# EAGLE design gadgiteration_v21 (EAGLE 6.4)
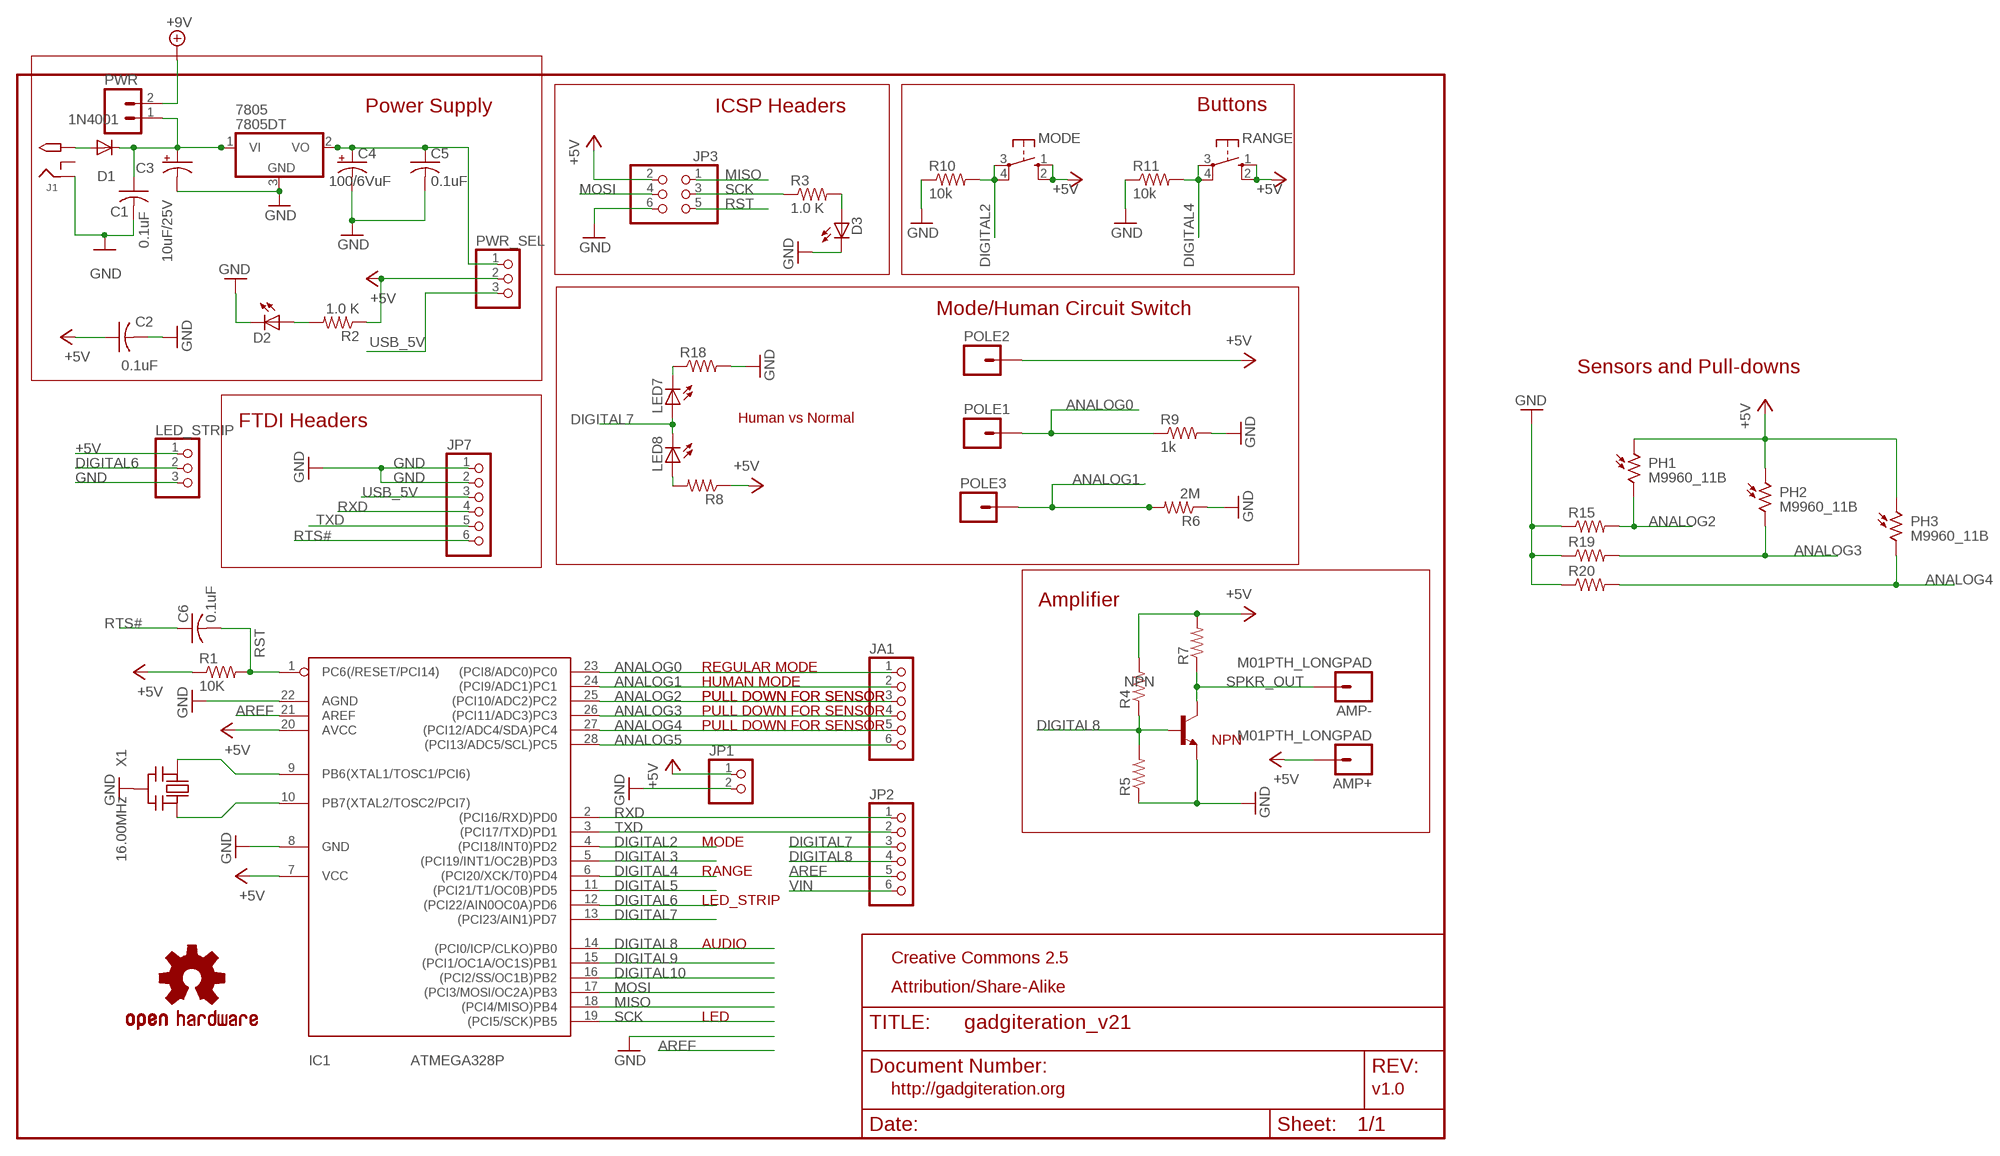
[diagram p0: schematic, sheet 1]

## Parts
7805  7805DT  [TO252]
AMP+  M01PTH_LONGPAD  [1X01_LONGPAD]
AMP-  M01PTH_LONGPAD  [1X01_LONGPAD]
C1  0.1uF  C-US025-025X050  [C025-025X050]
C2  0.1uF  C-US025-025X050  [C025-025X050]
C3  10uF/25V  CPOL-USE2.5-6  [E2,5-6]
C4  100/6VuF  CPOL-USE2.5-6  [E2,5-6]
C5  0.1uF  C-US025-025X050  [C025-025X050]
C6  0.1uF  C-US025-025X050  [C025-025X050]
D1  1N4001  DIODEPTH  [DIODE-1N4001]
D2  LED3MM  [LED3MM]
D3  Green  LED3MM  [LED3MM]
IC1  ATMEGA328P  ATMEGA168PROUND  [DIL28/3]
J1  2.1MMJACK  [PJ-102A]
JA1  PINHD-1X6CB  [1X06-CLEANBIG]
JP1  PINHD-1X2CB  [1X02-CB]
JP2  PINHD-1X6CB  [1X06-CLEANBIG]
JP3  PINHD-2X3  [2X03]
JP7  PINHD-1X6CLEAN  [1X06-CLEAN]
LED7  LED3MM  [LED3MM]
LED8  LED3MM  [LED3MM]
LED_STRIP  PINHD-1X3  [1X03]
LOGO1  OSHW-LOGOM  [OSHW-LOGO-M]
MODE  10-XX  [B3F-10XX]
NPN  -NPN-TO220V  [TO220V]
PH1  M9960_11B  [M9960]
PH2  M9960_11B  [M9960]
PH3  M9960_11B  [M9960]
POLE1  M01PTH_LONGPAD  [1X01_LONGPAD]
POLE2  M01PTH_LONGPAD  [1X01_LONGPAD]
POLE3  M01PTH_LONGPAD  [1X01_LONGPAD]
PWR  M02LOCK  [1X02_LOCK]
PWR_SEL  PINHD-1X3  [1X03]
R1  10K  R-US_0204/5  [0204/5]
R2  1.0 K  R-US_0204/5  [0204/5]
R3  1.0 K  R-US_0204/5  [0204/5]
R4  R-US_0204/5  [0204/5]
R5  R-US_0204/5  [0204/5]
R6  2M  R-US_0204/5  [0204/5]
R7  R-US_0204/5  [0204/5]
R8  R-US_0204/5  [0204/5]
R9  1k  R-US_0204/5  [0204/5]
R10  10k  R-US_0204/5  [0204/5]
R11  10k  R-US_0204/5  [0204/5]
R15  R-US_0204/5  [0204/5]
R18  R-US_0204/5  [0204/5]
R19  R-US_0204/5  [0204/5]
R20  R-US_0204/5  [0204/5]
RANGE  10-XX  [B3F-10XX]
X1  16.00MHz  CERMOSCILL  [CERM_OSC]

## Nets
+5V: AMP+.1 C2.1 IC1.7(VCC) IC1.20(AVCC) JP1.1 JP3.2 LED_STRIP.1 MODE.1(S) MODE.2(S1) PH1.1 PH2.1 PH3.1 POLE2.1 PWR_SEL.2 R1.1 R2.1 R4.2 R7.2 R8.1 RANGE.1(S) RANGE.2(S1)
+9V: PWR.2
ANALOG0: IC1.23((PCI8/ADC0)PC0) JA1.1 POLE1.1 R9.1
ANALOG1: IC1.24((PCI9/ADC1)PC1) JA1.2 POLE3.1 R6.2
ANALOG2: IC1.25((PCI10/ADC2)PC2) JA1.3 PH1.2 R15.2
ANALOG3: IC1.26((PCI11/ADC3)PC3) JA1.4 PH2.2 R19.2
ANALOG4: IC1.27((PCI12/ADC4/SDA)PC4) JA1.5 PH3.2 R20.2
ANALOG5: IC1.28((PCI13/ADC5/SCL)PC5) JA1.6
AREF: IC1.21(AREF) JP2.5
DIGITAL2: IC1.4((PCI18/INT0)PD2) MODE.3(P) MODE.4(P1) R10.2
DIGITAL3: IC1.5((PCI19/INT1/OC2B)PD3)
DIGITAL4: IC1.6((PCI20/XCK/T0)PD4) R11.2 RANGE.3(P) RANGE.4(P1)
DIGITAL5: IC1.11((PCI21/T1/OC0B)PD5)
DIGITAL6: IC1.12((PCI22/AIN0OC0A)PD6) LED_STRIP.2
DIGITAL7: IC1.13((PCI23/AIN1)PD7) JP2.3 LED7.A LED8.K(C)
DIGITAL8: IC1.14((PCI0/ICP/CLKO)PB0) JP2.4 NPN.1(B) R4.1 R5.2
DIGITAL9: IC1.15((PCI1/OC1A/OC1S)PB1)
DIGITAL10: IC1.16((PCI2/SS/OC1B)PB2)
GND: 7805.3(GND) C1.2 C2.2 C3.- C4.- C5.2 D2.K(C) D3.K(C) IC1.8(GND) IC1.22(AGND) J1.RING JP1.2 JP3.6 JP7.1 JP7.2 LED_STRIP.3 NPN.3(E) R5.1 R6.1 R9.2 R10.1 R11.1 R15.1 R18.2 R19.1 R20.1 X1.P$2(GND)
MISO: IC1.18((PCI4/MISO)PB4) JP3.1
MOSI: IC1.17((PCI3/MOSI/OC2A)PB3) JP3.4
N$1: IC1.9(PB6(XTAL1/TOSC1/PCI6)) X1.P$1(IN)
N$2: IC1.10(PB7(XTAL2/TOSC2/PCI7)) X1.P$3(OUT)
N$3: D2.A R2.2
N$4: D3.A R3.2
N$6: LED7.K(C) R18.1
N$7: LED8.A R8.2
N$17: D1.A J1.TIP
N$22: 7805.2(VO) C4.+ C5.1 PWR_SEL.1
RST: C6.2 IC1.1(PC6(/RESET/PCI14)) JP3.5 R1.2
RTS#: C6.1 JP7.6
RXD: IC1.2((PCI16/RXD)PD0) JP2.1 JP7.4
SCK: IC1.19((PCI5/SCK)PB5) JP3.3 R3.1
SPKR_OUT: AMP-.1 NPN.2(C) R7.1
TXD: IC1.3((PCI17/TXD)PD1) JP2.2 JP7.5
USB_5V: JP7.3 PWR_SEL.3
VIN: 7805.1(VI) C1.1 C3.+ D1.C JP2.6 PWR.1
Unconnected: J1.RING_SW

## Notes on the sheet
- Power Supply | ICSP Headers | Buttons
- Mode/Human Circuit Switch
- Sensors and Pull-downs
- Human vs Normal
- FTDI Headers
- Amplifier
- REGULAR MODE
- HUMAN MODE
- PULL DOWN FOR SENSOR | PULL DOWN FOR SENSOR
- PULL DOWN FOR SENSOR
- PULL DOWN FOR SENSOR
- NPN
- MODE
- RANGE
- LED_STRIP
- AUDIO
- Creative Commons 2.5
- Attribution/Share-Alike
- LED
- http://gadgiteration.org | v1.0

## Library data of the parts
7805 = linear:78*: Positive VOLTAGE REGULATOR Source: http://cache.national.com/ds/LM/LM78L05.pdf http://www.fairchildsemi.com/ds/LM/LM7805.pdf
AMP+ AMP- POLE1-POLE3 = SparkFun-Connectors:M01: Header 1 Standard 1-pin 0.1" header. Use with straight break away headers (SKU : PRT-00116), right angle break away headers (PRT-00553), swiss pins (PRT-00743), machine pins (PRT-00117), and female headers (PRT-00115).
C1 C2 C5 C6 = minimidi:C-US: CAPACITOR, American symbol
C3 C4 = minimidi:CPOL-US: POLARIZED CAPACITOR, American symbol
D1 = SparkFun-DiscreteSemi:DIODE: Diode These are standard reverse protection diodes and small signal diodes. SMA package can handle up to about 1A. SOD-323 can handle about 200mA. What the SOD-323 package when ordering, there are some mfgs out there that are 5-pin packages.
D2 D3 = minimidi:LED: LED OSRAM: - CHIPLED LG R971, LG N971, LY N971, LG Q971, LY Q971, LO R971, LY R971 LH N974, LH R974 LS Q976, LO Q976, LY Q976 LO Q996 - Hyper CHIPLED LW Q18S LB Q993, LB Q99A, LB R99A - SideLED LS A670, LO A670, LY A670, LG A670, LP A670 LB A673, LV A673, LT A673, LW A673 LH A674 LY A675 LS A676, LA A676, LO A676, LY A676, LW A676 LS A679, LY A679, LG A679 - Hyper Micro SIDELED® LS Y876, LA Y876, LO Y876, LY Y876 LT Y87S - SmartLED LW L88C, LW L88S LB L89C, LB L89S, LG L890 LS L89K, LO L89K, LY L89K LS L896, LA L896, LO L896, LY L896 - TOPLED LS T670, LO T670, LY T670, LG T670, LP T670 LSG T670, LSP T670, LSY T670, LOP T670, LYG T670 LG T671, LOG T671, LSG T671 LB T673, LV T673, LT T673, LW T673 LH T674 LS T676, LA T676, LO T676, LY T676, LB T676, LH T676, LSB T676, LW T676 LB T67C, LV T67C, LT T67C, LS T67K, LO T67K, LY T67K, LW E67C LS E67B, LA E67B, LO E67B, LY E67B, LB E67C, LV E67C, LT E67C LW T67C LS T679, LY T679, LG T679 LS T770, LO T770, LY T770, LG T770, LP T770 LB T773, LV T773, LT T773, LW T773 LH T774 LS E675, LA E675, LY E675, LS T675 LS T776, LA T776, LO T776, LY T776, LB T776 LHGB T686 LT T68C, LB T68C - Hyper Mini TOPLED® LB M676 - Mini TOPLED Santana® LG M470 LS M47K, LO M47K, LY M47K Source: http://www.osram.convergy.de/
IC1 = avr:ATMEGA168*P: MICROCONTROLLER 16 kBytes FLASH 1 kBytes SRAM 512 Bytes EEPROM USART 8-channel 10 bit ADC
J1 = minimidi:2.1MMJACK
JA1 JP7 = carduino:PINHD-1X6: PIN HEADER
JP1 = carduino:PINHD-1X2: PIN HEADER
JP2 = adafruit:PINHD-1X6: PIN HEADER
JP3 = pinhead-ez:PINHD-2X3: PIN HEADER
LED7 LED8 = adafruit:LED: LED OSRAM: - CHIPLED LG R971, LG N971, LY N971, LG Q971, LY Q971, LO R971, LY R971 LH N974, LH R974 LS Q976, LO Q976, LY Q976 LO Q996 - Hyper CHIPLED LW Q18S LB Q993, LB Q99A, LB R99A - SideLED LS A670, LO A670, LY A670, LG A670, LP A670 LB A673, LV A673, LT A673, LW A673 LH A674 LY A675 LS A676, LA A676, LO A676, LY A676, LW A676 LS A679, LY A679, LG A679 - Hyper Micro SIDELED® LS Y876, LA Y876, LO Y876, LY Y876 LT Y87S - SmartLED LW L88C, LW L88S LB L89C, LB L89S, LG L890 LS L89K, LO L89K, LY L89K LS L896, LA L896, LO L896, LY L896 - TOPLED LS T670, LO T670, LY T670, LG T670, LP T670 LSG T670, LSP T670, LSY T670, LOP T670, LYG T670 LG T671, LOG T671, LSG T671 LB T673, LV T673, LT T673, LW T673 LH T674 LS T676, LA T676, LO T676, LY T676, LB T676, LH T676, LSB T676, LW T676 LB T67C, LV T67C, LT T67C, LS T67K, LO T67K, LY T67K, LW E67C LS E67B, LA E67B, LO E67B, LY E67B, LB E67C, LV E67C, LT E67C LW T67C LS T679, LY T679, LG T679 LS T770, LO T770, LY T770, LG T770, LP T770 LB T773, LV T773, LT T773, LW T773 LH T774 LS E675, LA E675, LY E675, LS T675 LS T776, LA T776, LO T776, LY T776, LB T776 LHGB T686 LT T68C, LB T68C - Hyper Mini TOPLED® LB M676 - Mini TOPLED Santana® LG M470 LS M47K, LO M47K, LY M47K Source: http://www.osram.convergy.de/
LED_STRIP PWR_SEL = pinhead:PINHD-1X3: PIN HEADER
LOGO1 = SparkFun-Aesthetics:OSHW-LOGO: Open Source Hardware Logo This logo indicates the piece of hardware it is found on incorporates a OSHW license and/or adheres to the definition of open source hardware found here: http://freedomdefined.org/OSHW
MODE RANGE = switch-omron:10-XX: OMRON SWITCH
NPN = transistor:*-NPN-: NPN Transistror BF959 corrected 2008.03.06
PH1-PH3 = photo-elements:M9960_11: Photo Sensor Beacon Light, Photometer Applications Source: http://optoelectronics.perkinelmer.com/content/Datasheets/DTS_M9960.pdf
PWR = SparkFun-Connectors:M02: Header 2 Standard 2-pin 0.1" header. Use with straight break away headers (SKU : PRT-00116), right angle break away headers (PRT-00553), swiss pins (PRT-00743), machine pins (PRT-00117), and female headers (PRT-00115). Molex polarized connector foot print use with SKU : PRT-08233 with associated crimp pins and housings.
R1-R11 R15 R18-R20 = adafruit:R-US_: RESISTOR, American symbol
X1 = digg:CERMOSCILL

## Board
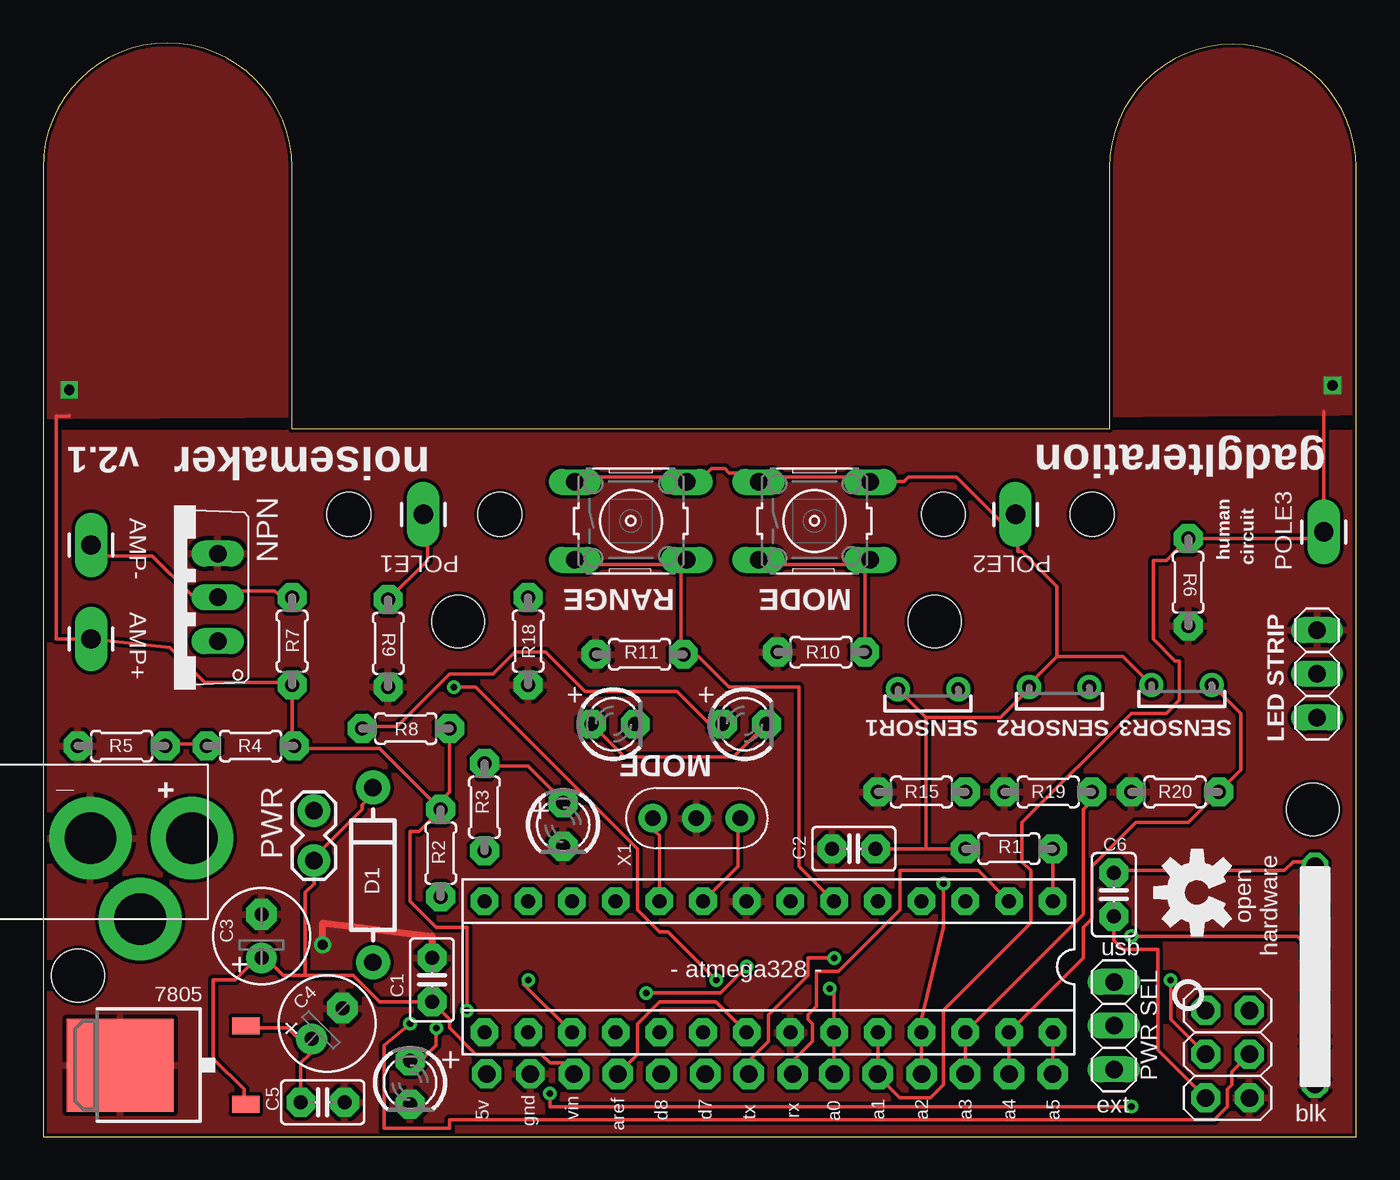
[diagram p1: board, top side]
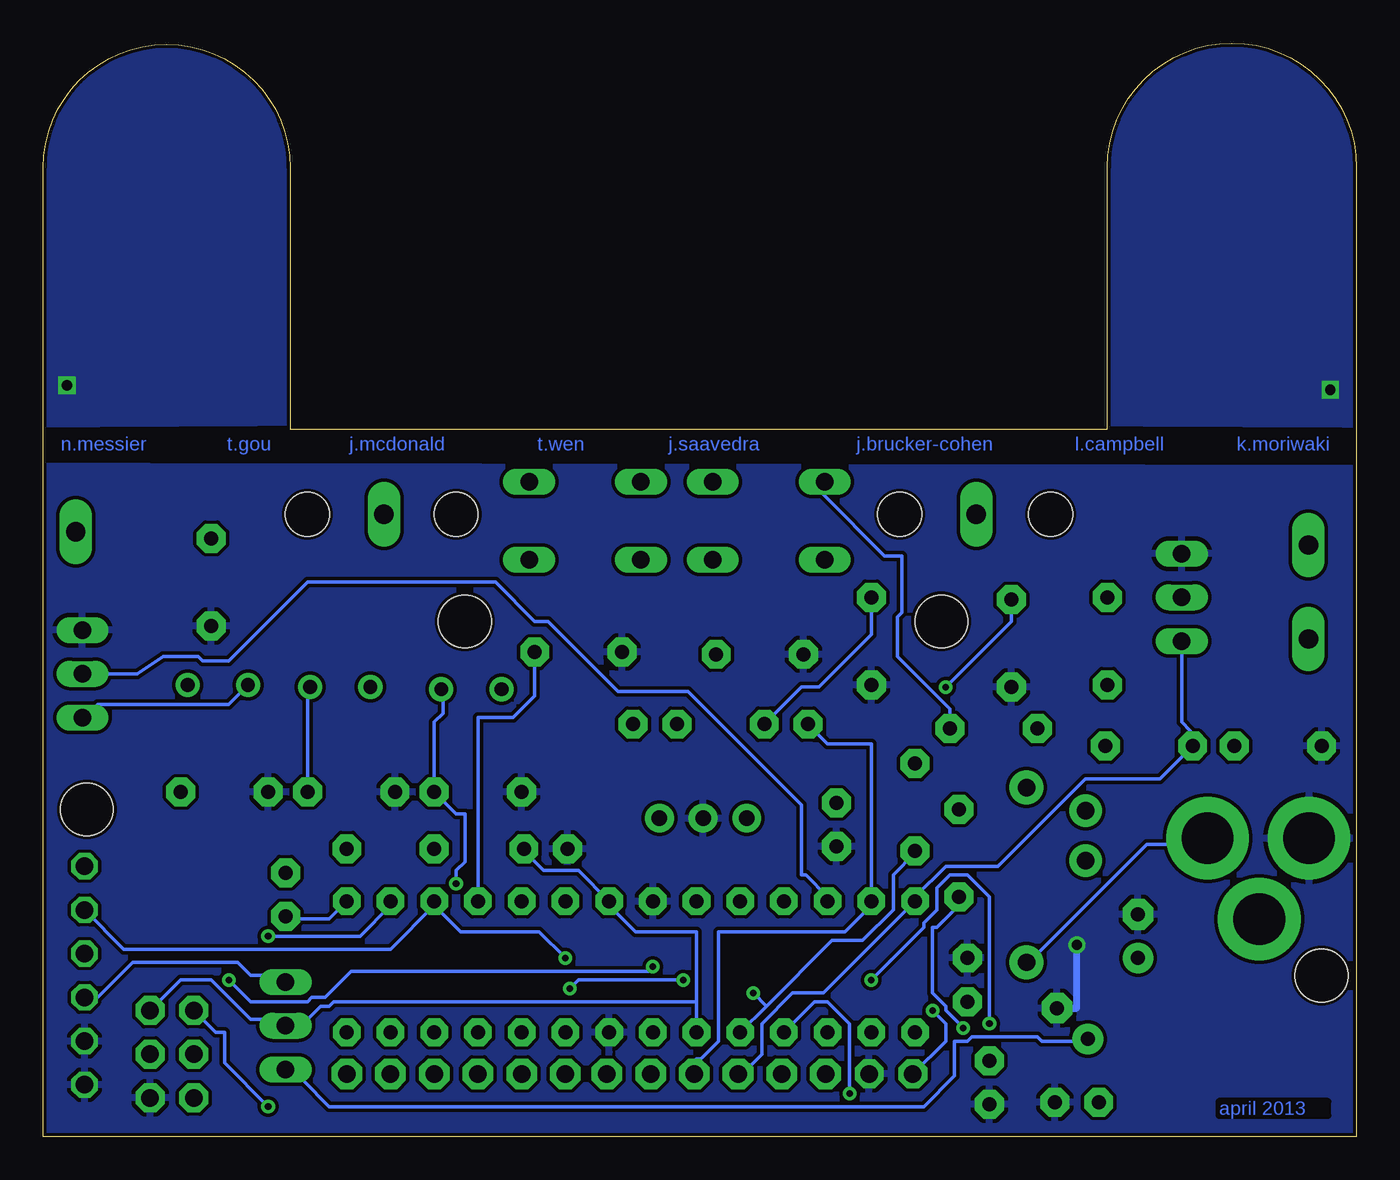
[diagram p2: board, bottom side, seen from below]

Size 76.31 x 63.55 mm. Coordinates in mm from the lower left corner, seen from the top.
Outline: 0,0 76.31,0 76.31,56.31 arc180 61.97,56.31 61.97,41.11 14.47,41.11 14.47,56.31 arc180 0,56.31 0,0
Copper layers (1*16): Top 0.035mm / dielectric 1.5mm / Bottom 0.035mm
Design rules "default": minimum track width 8mil, minimum drill 15mil, track to track 8mil, track to pad 8mil, pad to pad 10mil, via to via 10mil, smd to smd 0mil, copper to edge 8mil, drill to drill 8mil, minimum pad ring 10mil, minimum via ring 8mil, stop-mask expansion 4mil, vias tented up to drill 0mil, thermal gap 10mil
Holes 3.05 mm at 24.12,29.93 73.78,19.01 51.81,29.93 2.03,9.36
Holes 2.54 mm at 17.77,36.16 26.54,36.16 60.96,36.16 52.32,36.16

### Footprints (pad centres in the part's own frame; a part is rotated, then mirrored left to right if it is on the bottom)
TO252 = smd 1 x 1.6: 1 -2.28,-4.8; 2 2.28,-4.8 | smd 5.4 x 6.2: 3 0,2.5
1X01_LONGPAD = drill 1.118 pad 1.88 long: 1 0,0
C025-025X050 = drill 0.813 pad 1.676 octagon: 1 -1.27,0; 2 1.27,0
E2,5-6 = drill 0.813 pad 1.778: + -1.27,0 | drill 0.813 pad 1.778 octagon: - 1.27,0
DIODE-1N4001 = drill 1 pad 1.981: A -5.08,0; C 5.08,0
LED3MM = drill 0.813 pad 1.676 octagon: A -1.27,0; K 1.27,0
DIL28/3 = drill 0.813 pad 1.6 octagon: 1 -16.51,-3.81; 2 -13.97,-3.81; 3 -11.43,-3.81; 4 -8.89,-3.81; 5 -6.35,-3.81; 6 -3.81,-3.81; 7 -1.27,-3.81; 8 1.27,-3.81; 9 3.81,-3.81; 10 6.35,-3.81; 11 8.89,-3.81; 12 11.43,-3.81; 13 13.97,-3.81; 14 16.51,-3.81; 15 16.51,3.81; 16 13.97,3.81; 17 11.43,3.81; 18 8.89,3.81; 19 6.35,3.81; 20 3.81,3.81; 21 1.27,3.81; 22 -1.27,3.81; 23 -3.81,3.81; 24 -6.35,3.81; 25 -8.89,3.81; 26 -11.43,3.81; 27 -13.97,3.81; 28 -16.51,3.81
PJ-102A = drill 3 pad 4.8: RING 0.1,-3.39; RING_SW -4.6,-6.29; TIP 0.1,-9.29
1X06-CLEANBIG = drill 1.016 pad 1.778 octagon: 1 -6.35,0; 2 -3.81,0; 3 -1.27,0; 4 1.27,0; 5 3.81,0; 6 6.35,0
1X02-CB = drill 1.016 pad 1.676 octagon: 1 -1.27,0; 2 1.27,0
2X03 = drill 1.016 pad 1.676 octagon: 1 -2.54,-1.27; 2 -2.54,1.27; 3 0,-1.27; 4 0,1.27; 5 2.54,-1.27; 6 2.54,1.27
1X06-CLEAN = drill 1.016 octagon: 1 -6.35,0; 2 -3.81,0; 3 -1.27,0; 4 1.27,0; 5 3.81,0; 6 6.35,0
1X03 = drill 1.016 long: 1 -2.54,0; 2 0,0; 3 2.54,0
B3F-10XX = drill 1.016 long: 1 -3.251,2.261; 2 3.251,2.261; 3 -3.251,-2.261; 4 3.251,-2.261
TO220V = drill 1.016 long: 1 -2.54,-2.54; 2 0,-2.54; 3 2.54,-2.54
M9960 = drill 0.8 pad 1.4: 1 -1.75,0; 2 1.75,0
1X02_LOCK = drill 1.016 pad 1.88: 1 -0.178,0; 2 2.718,0
0204/5 = drill 0.813 pad 1.676 octagon: 1 -2.54,0; 2 2.54,0
CERM_OSC = drill 0.9 pad 1.676: P$1 -2.54,0; P$2 0,0; P$3 2.54,0

### Placement (x,y rotation side)
7805  6.98,4.15 90 top
AMP+  2.79,28.92 0 top
AMP-  2.79,34.38 0 top
C1  22.6,9.11 90 top
C2  47.11,16.73 180 top
C3  12.7,11.65 90 top
C4  16.5,6.57 45 top
C5  16.25,1.99 0 top
C6  62.23,14.06 270 top
D1  19.17,15.2 90 top
D2  21.33,3.14 270 top
D3  30.22,18.12 270 top
IC1  42.16,9.87 180 top
J1  -0.64,17.23 90 top
JA1  52.32,3.65 0 top
JP1  27.05,3.65 0 top
JP2  37.21,3.65 180 top
JP3  68.83,4.79 270 top
JP7  73.91,9.36 90 top
LED7  33.14,23.96 0 top
LED8  40.76,23.96 0 top
LED_STRIP  74.04,26.89 90 top
LOGO1  67.05,14.19 90 top
MODE  44.83,35.78 0 top
NPN  7.61,31.33 90 top
PH1  51.43,26 0 top
PH2  59.05,26.12 0 top
PH3  66.16,26.25 0 top
POLE1  22.09,36.16 0 top
POLE2  56.51,36.16 0 top
POLE3  74.42,35.14 180 top
PWR  15.74,16.22 90 top
PWR_SEL  62.23,6.44 90 top
R1  56.13,16.73 0 top
R2  23.11,16.47 270 top
R3  25.65,19.14 90 top
R4  12.06,22.7 0 top
R5  4.57,22.7 0 top
R6  66.54,32.22 90 top
R7  14.47,28.79 270 top
R8  21.08,23.71 180 top
R9  20.06,28.66 270 top
R10  45.21,28.16 0 top
R11  34.67,28.03 0 top
R15  51.05,20.03 0 top
R18  28.19,28.79 270 top
R19  58.41,20.03 0 top
R20  65.78,20.03 0 top
RANGE  34.16,35.78 0 top
X1  37.97,18.5 180 top

### Tracks (layer width: path | path; a pad name or v marks a point on that pad's centre or on a via)
+5V  (via drill 0.38, 0.6)
  Top 0.203: v24.63,7.33 24.63,12.15 22.86,12.15 21.33,13.68 21.33,17.74 21.84,17.74 R2.1 23.11,19.52 | R8.1 23.62,20.03 23.11,19.52 | 23.11,19.52 22.6,19.52 19.55,22.57 14.73,22.57 R4.2 14.47,22.82 R7.2 14.47,26.38 9.39,26.38 7.36,28.41 AMP+.1 0.76,28.92 0.76,41.87 1.52,41.87 1.52,41.9 | 41.65,38.32 41.14,38.32 40.89,38.57 39.87,38.57 39.62,38.82 38.86,38.82 38.09,38.06 37.59,38.06 RANGE.2 37.33,38.06 37.08,38.32 31.24,38.32 30.98,38.06 RANGE.1 | 41.65,38.32 47.75,38.32 48,38.06 MODE.2 48.26,38.06 50.03,38.06 50.29,38.32 53.08,38.32 55.62,35.78 56.38,35.78 POLE2.1 56.64,35.52 56.64,34 56.89,34 58.92,31.97 58.92,27.9 | R1.1 51.3,16.73 | 51.3,16.73 C2.1 | 51.3,24.35 49.78,25.87 PH1.1 | 51.3,24.35 55.62,24.35 57.4,26.12 PH2.1 57.15,26.12 58.92,27.9 | 58.92,27.9 62.73,27.9 64.26,26.38 PH3.1 | 51.3,24.35 51.3,16.73 | 41.65,38.32 41.65,38.06 MODE.1
  Bottom 0.203: JP1.1 23.87,5.55 23.87,6.57 v24.63,7.33 | 62.23,6.57 62.48,6.82 64.26,6.82 66.54,9.11 68.32,9.11 JP3.2 | 38.35,7.84 38.35,11.9 41.91,11.9 43.43,13.42 IC1.7 45.21,15.46 47.24,15.46 48.51,16.73 C2.1 | 38.35,7.84 IC1.20 | 62.23,6.57 61.97,6.82 60.96,6.82 60.19,7.58 59.69,7.58 59.43,7.84 38.35,7.84 | 62.23,6.57 PWR_SEL.2 | R8.1 23.62,24.85 26.66,27.9 26.66,30.19 26.41,30.44 26.41,33.74 27.43,33.74 30.98,37.3 30.98,37.81 RANGE.1 | LED_STRIP.1 73.91,24.35 73.15,25.11 65.53,25.11 64.51,26.12 PH3.1
  other vias: 1.52,43.4
  pour Top: -2.93,65.11 -3.31,41.87 16.76,42 16.76,64.48
  pour Bottom: 18.16,41.49 -4.96,41.36 -5.08,66.26 17.77,65.62
ANALOG0  (via drill 0.38)
  Top 0.203: JA1.1 IC1.23 45.97,8.6 v45.72,8.6 | R9.1 22.35,33.49 22.35,36.03 POLE1.1 | v39.11,9.11 36.32,11.9 35.81,11.9 34.54,13.17 34.54,16.73 25.14,26.12 v23.87,26.12
  Bottom 0.203: v45.72,8.6 45.21,9.11 v39.11,9.11 | v23.87,26.12 20.06,29.93 R9.1
ANALOG1  (via drill 0.6)
  Top 0.203: IC1.24 JA1.2 48.51,3.52 49.78,2.25 51.56,2.25 52.32,3.01 52.32,7.33 57.4,12.41 57.4,15.46 56.89,15.96 56.89,18.25 63.24,24.6 65.27,24.6 66.03,25.36 66.03,27.65 65.78,27.65 64.51,28.92 64.51,33.49 65.27,33.49 R6.2 74.16,34.76 74.42,35.01 POLE3.1 74.42,42.13
  other vias: 74.92,43.65
  pour Top: 57.78,64.22 60.07,42 79.12,42.13 80.51,64.61
  pour Bottom: 58.29,64.73 59.3,41.49 77.59,41.36 79.24,64.61
ANALOG2  (via drill 0.38)
  Top 0.203: JA1.3 IC1.25 51.05,6.82 52.32,12.15 v52.32,14.69
  Bottom 0.203: PH1.2 53.08,25.87 53.08,24.6 53.59,24.09 R15.2 52.32,18.76 51.81,18.76 51.81,15.96 52.32,15.46 v52.32,14.69
ANALOG3
  Top 0.203: JA1.4 IC1.26 60.45,12.92 60.45,19.01 60.96,19.52 R19.2
  Bottom 0.203: R19.2 60.96,26.12 PH2.2
ANALOG4
  Top 0.203: JA1.5 IC1.27 60.45,10.38 60.45,12.15 60.96,12.66 60.96,15.71 63.5,18.25 66.54,18.25 R20.2 69.59,21.3 69.59,24.6 68.07,26.12 PH3.2
ANALOG5
  Top 0.203: JA1.6 IC1.28
AREF
  Top 0.203: IC1.21 39.11,7.84 35.81,7.84 34.54,6.57 34.54,4.79 JP2.5
DIGITAL2
  Top 0.203: R10.2 47.75,33.24 | 47.75,33.24 41.91,33.24 41.65,33.49 MODE.3 | 47.75,33.24 MODE.4
  Bottom 0.203: IC1.4 51.05,24.35 49.02,24.35 47.75,25.62 R10.2
DIGITAL4
  Top 0.203: 37.08,33.24 31.24,33.24 30.98,33.49 RANGE.3 | IC1.6 43.94,15.71 43.94,26.12 39.87,26.12 38.09,27.9 37.33,27.9 R11.2 37.08,28.16 37.08,33.24 | 37.08,33.24 37.33,33.49 RANGE.4
DIGITAL6
  Bottom 0.203: IC1.12 30.73,13.93 32,15.2 32.25,15.2 32.25,19.27 38.86,25.87 42.92,25.87 46.98,29.93 47.75,29.93 50.03,32.22 60.96,32.22 65.53,27.65 67.05,27.65 67.3,27.9 69.34,27.9 70.86,26.89 LED_STRIP.2
DIGITAL7
  Top 0.203: LED8.K 40.13,22.06 33.78,22.06 LED7.A
  Bottom 0.203: LED7.A 30.73,22.82 28.19,22.82 IC1.13 28.19,13.42 29.71,11.9 37.08,11.9 37.08,5.55 38.09,4.53 38.35,4.53 38.35,3.77 JP2.3
DIGITAL8
  Top 0.203: R5.2 7.11,22.82 9.39,22.82 R4.1
  Bottom 0.203: NPN.1 10.16,24.09 9.65,23.58 9.65,22.82 R4.1 11.43,20.79 15.74,20.79 20.82,15.71 23.87,15.71 25.65,13.93 IC1.14 30.98,8.34 32.76,8.34 34.54,6.57 34.54,4.79 35.55,3.77 35.81,3.77 JP2.4
GND  (via drill 0.6)
  Top 0.406: v16.25,11.14 16.25,12.41 22.6,11.65 C1.2
  Bottom 0.203: C1.2
  Bottom 0.406: C4.- 16.25,7.46 v16.25,11.14
  pour Bottom: -6.99,38.82 89.4,38.95 84.58,-3.59 -5.59,-2.58
  pour Top: -6.99,40.86 -6.74,-4.48 84.96,-3.59 84.58,40.86
MISO  (via drill 0.38)
  Top 0.203: v29.46,2.5 29.46,1.74 v63.24,1.74
  Bottom 0.203: IC1.18 31.49,7.84 30.73,7.84 29.46,6.57 v29.46,2.5 | v63.24,1.74 65.78,4.28 65.78,6.06 66.29,6.06 JP3.1
MOSI  (via drill 0.38)
  Top 0.203: JP3.4 69.08,3.77 69.08,3.01 68.83,2.76 68.83,1.74 68.07,0.98 23.62,0.98 23.62,0.47 19.81,0.47 19.81,5.3 v21.33,6.57 | IC1.17 27.93,8.85 v28.19,9.11
  Bottom 0.203: v28.19,9.11 25.14,12.15 25.14,12.41 24.38,13.17 24.38,14.44 23.62,15.2 22.6,15.2 21.33,13.93 v21.33,6.57
N$1
  Top 0.203: IC1.9 40.38,15.71 40.38,18.5 X1.P$1
N$2
  Top 0.203: IC1.10 35.81,17.49 35.55,17.74 35.55,18.5 X1.P$3
N$3  (via drill 0.38)
  Top 0.203: v22.86,6.31 22.86,5.3 21.58,4.03 D2.A
  Bottom 0.203: v22.86,6.31 23.87,7.33 23.87,7.58 24.63,8.34 24.63,12.15 24.38,12.15 23.11,13.42 R2.2
N$4
  Top 0.203: D3.A 30.22,19.52 28.19,21.55 25.65,21.55 R3.2
N$6
  Bottom 0.203: LED7.K 32.25,26.12 31.24,26.12 28.19,29.17 R18.1
N$7
  Top 0.203: R8.2 18.54,23.84 20.57,23.84 23.62,26.89 26.16,26.89 27.43,28.16 29.2,28.16 31.49,25.87 36.83,25.87 38.6,24.09 39.37,24.09 LED8.A
N$17
  Bottom 0.203: D1.A 19.04,10.12 12.19,16.98 9.14,16.98 8.88,17.23 J1.TIP
N$22
  Top 0.203: 7805.2 11.93,6.31 14.22,6.31 14.73,5.8 15.49,5.8 C4.+ 15.49,5.55 15.49,4.79 14.98,4.28 C5.1
  Bottom 0.203: PWR_SEL.1 62.23,3.77 61.72,3.26 61.21,3.26 59.69,1.74 25.14,1.74 23.36,3.52 23.36,5.55 22.6,5.55 22.35,5.8 18.54,5.8 18.28,5.55 15.74,5.55 C4.+
RST
  Top 0.203: R1.2 IC1.1 | JP3.5 64.77,5.04 64.77,10.88 62.73,10.88 62.23,11.39 C6.2
  Bottom 0.203: IC1.1 59.69,12.66 62.23,12.66 C6.2
RTS#
  Top 0.203: JP7.6 73.66,15.96 72.64,15.96 72.13,15.46 62.23,15.46 C6.1
RXD  (via drill 0.38)
  Top 0.203: JP7.4 72.89,11.65 v63.24,11.65 | IC1.2 54.35,15.46 49.78,15.46 49.78,13.17 46.22,9.61 44.95,9.61 44.95,7.58 44.45,7.07 44.45,6.82 44.7,6.57 44.7,5.55 43.68,4.53 43.68,3.77 JP2.1
  Bottom 0.203: v63.24,11.65 57.91,11.65 56.13,13.42 IC1.2
SCK  (via drill 0.38)
  Top 0.203: JP3.3 65.53,6.82 v65.53,9.11 | v40.89,9.87 39.37,8.34 v35.05,8.34
  Bottom 0.203: 34.29,7.58 30.47,11.39 28.7,11.39 26.92,13.17 26.92,15.2 25.65,16.47 R3.1 | 34.29,7.58 IC1.19 | v65.53,9.11 64.26,7.84 60.96,7.84 60.7,8.09 59.94,8.09 58.41,9.61 41.14,9.61 v40.89,9.87 | 34.29,7.58 v35.05,8.34
SPKR_OUT
  Top 0.203: 10.16,31.46 10.41,31.71 13.46,31.71 13.71,31.46 14.47,31.46 R7.1 | 10.16,31.46 8.63,31.46 6.34,33.74 2.54,33.74 2.03,34.25 AMP-.1 | 10.16,31.46 NPN.2
TXD  (via drill 0.38)
  Top 0.203: v45.97,10.38 44.45,10.38 44.45,9.36 42.16,7.07 42.16,5.55 41.14,4.53 41.14,3.77 JP2.2
  Bottom 0.203: JP7.5 71.62,10.88 56.13,10.88 53.59,13.42 | v45.97,10.38 47.49,11.9 52.07,11.9 53.59,13.42 | 53.59,13.42 IC1.3
USB_5V
  Bottom 0.203: JP7.3 73.15,8.09 71.11,10.12 65.02,10.12 64.26,9.36 62.48,9.36 62.23,9.11 PWR_SEL.3
VIN
  Top 0.203: D1.C 19.04,20.28 19.04,19.77 18.54,19.27 18.54,19.01 15.74,16.22 PWR.1 15.74,14.69 15.24,14.19 15.24,9.36 | 7805.1 11.68,1.99 11.68,2.76 9.9,4.53 9.9,9.11 11.17,9.11 12.44,10.38 C3.+ 12.95,10.38 13.96,9.36 15.24,9.36 | 15.24,9.36 18.03,9.36 19.55,7.84 C1.1 23.62,6.82 23.62,6.31 25.14,4.79 28.95,4.79 29.46,4.28 30.22,4.28 JP2.6

### Text on the board
Bottom: k.moriwaki | l.campbell | j.brucker-cohen | j.saavedra | t.wen | j.mcdonald | t.gou | n.messier | april 2013
tPlace: v2.1 | noisemaker | gadgIteration | human | circuit | _ | + | R3 | + | R1 | C6 | R2 | X1 | C2 | D1 | C3 | usb | open | hardware | - atmega328 - | C1 | C4 | + | C5 | PWR SEL | vin | tx | rx | 5v | gnd | d8 | d7 | a0 | a1 | a2 | a3 | a4 | a5 | ext | blk | aref
tNames: MODE | SENSOR1 | SENSOR2 | SENSOR3 | LED STRIP | MODE | MODE